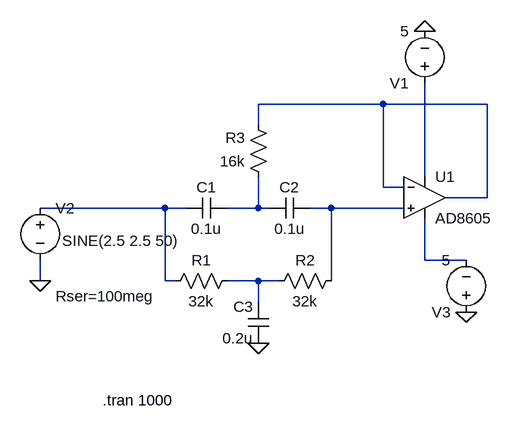
[diagram p0: schematic 50Hz陷波.asc]
50Hz陷波.asc, the LTspice schematic file:
Version 4.1
SHEET 1 880 680
WIRE 256 -48 64 -48
WIRE 416 -48 256 -48
WIRE 64 -16 64 -48
WIRE 320 64 320 -80
WIRE 256 80 256 -48
WIRE 288 80 256 80
WIRE 416 96 416 -48
WIRE 416 96 352 96
WIRE -80 112 -272 112
WIRE -48 112 -80 112
WIRE 64 112 64 64
WIRE 64 112 16 112
WIRE 80 112 64 112
WIRE 176 112 144 112
WIRE 288 112 176 112
WIRE 320 192 320 128
WIRE 384 192 320 192
WIRE -272 224 -272 192
WIRE -80 224 -80 112
WIRE -64 224 -80 224
WIRE 64 224 16 224
WIRE 96 224 64 224
WIRE 176 224 176 112
WIRE 64 256 64 224
FLAG 64 320 0
FLAG -272 224 0
FLAG 384 272 0
FLAG 320 -160 0
SYMBOL cap 16 96 R90
WINDOW 0 0 32 VBottom 2
WINDOW 3 32 32 VTop 2
SYMATTR InstName C1
SYMATTR Value 0.1u
SYMBOL cap 144 96 R90
WINDOW 0 0 32 VBottom 2
WINDOW 3 32 32 VTop 2
SYMATTR InstName C2
SYMATTR Value 0.1u
SYMBOL cap 80 320 R180
WINDOW 0 24 56 Left 2
WINDOW 3 24 8 Left 2
SYMATTR InstName C3
SYMATTR Value 0.2u
SYMBOL res 32 208 R90
WINDOW 0 0 56 VBottom 2
WINDOW 3 32 56 VTop 2
SYMATTR InstName R1
SYMATTR Value 32k
SYMBOL res 192 208 R90
WINDOW 0 0 56 VBottom 2
WINDOW 3 32 56 VTop 2
SYMATTR InstName R2
SYMATTR Value 32k
SYMBOL res 80 80 R180
WINDOW 0 36 76 Left 2
WINDOW 3 36 40 Left 2
SYMATTR InstName R3
SYMATTR Value 16k
SYMBOL OpAmps\\AD8605 320 32 R0
SYMATTR InstName U1
SYMBOL voltage 320 -64 R180
WINDOW 123 0 0 Left 0
WINDOW 39 0 0 Left 0
SYMATTR InstName V1
SYMATTR Value 5
SYMBOL voltage -272 96 R0
WINDOW 3 34 66 Left 2
WINDOW 123 24 124 Left 2
WINDOW 39 24 152 Left 2
SYMATTR InstName V2
SYMATTR Value SINE(2.5 2.5 50)
SYMATTR SpiceLine Rser=100meg
SYMBOL voltage 384 288 R180
WINDOW 123 0 0 Left 0
WINDOW 39 0 0 Left 0
SYMATTR InstName V3
SYMATTR Value 5
TEXT -176 408 Left 2 !.tran 1000

The netlist it stands for:
* 50Hz陷波.asc
C1 N004 N003 0.1u
C2 N005 N004 0.1u
C3 0 N007 0.2u
R1 N007 N003 32k
R2 N005 N007 32k
R3 N004 N001 16k
X§U1 N005 N001 N002 N006 N001 AD8605  ; pins In+ In- V+ V- OUT
V1 N002 0 5
V2 N003 0 SINE(2.5 2.5 50) Rser=100meg
V3 0 N006 5
.tran 1000
.lib ADI.lib
.backanno
.end